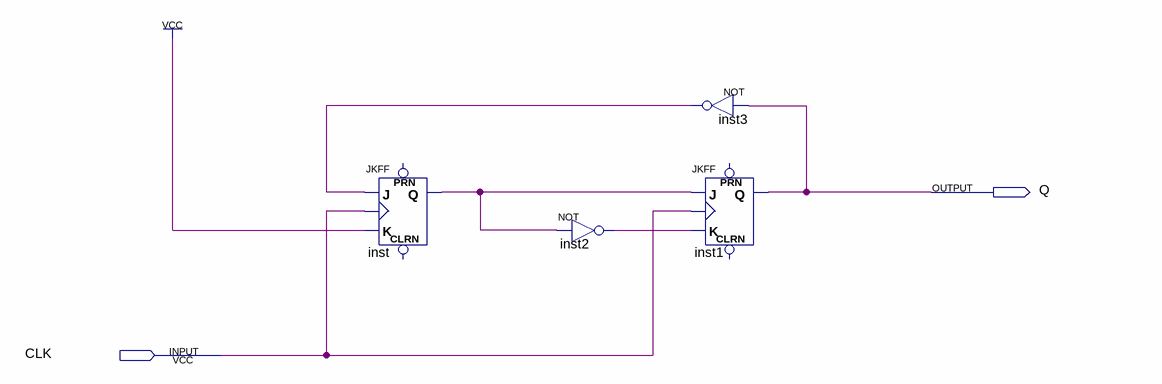
[diagram p0: schematic sheet]
// Quartus schematic ThreeBunshu.bdf as structural Verilog: 4 symbols, 2 pins
module ThreeBunshu (
  input  CLK,
  output Q
);

  wire inst2_out, inst3_out, inst_q;

  JKFF inst (.K(1'b1), .J(inst3_out), .CLK(CLK), .Q(inst_q));  // open: PRN, CLRN
  not inst2 (inst2_out, inst_q);
  not inst3 (inst3_out, Q);
  JKFF inst1 (.K(inst2_out), .J(inst_q), .CLK(CLK), .Q(Q));  // open: PRN, CLRN
endmodule
